# Altium project 2nd_design.PrjPcb
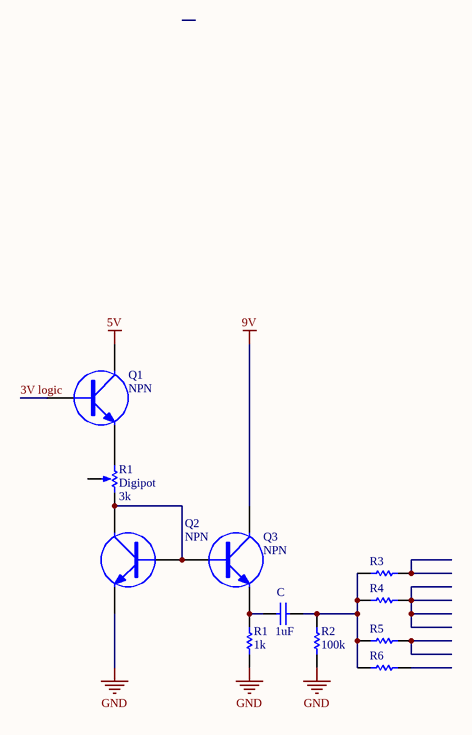
[diagram p0: noConverter.SchDoc]
1 sheet, 11 parts. Net scope: global (net labels, ports and power ports of the same name join across sheets).

## Sheet noConverter.SchDoc
size A

### Parts
(Parts that share a designator on the sheet are numbered #1, #2 ... from top to bottom, then left to right.)
C  value 1uF  [CC5750-2220]  (hidden comment: Cap-NP)
Q1  NPN  [TO-92A]
Q2  NPN  [TO-92A]
Q3  NPN  [TO-92A]
R1#1  Digipot  value 3k  [VR_MUL-H]
R1#2  value 1k  [CC4521-1808]  (hidden comment: Res)
R2  value 100k  [CC4521-1808]  (hidden comment: Res)
R3  Res  [CC4521-1808]  (value not drawn)
R4  Res  [CC4521-1808]  (value not drawn)
R5  Res  [CC4521-1808]  (value not drawn)
R6  Res  [CC4521-1808]  (value not drawn)

### Nets
5V: Q1.1(C)
9V: Q3.1(C)
GND: Q2.3(E) R1#2.2 R2.2
3V logic: Q1.2(B)
NetC_1: C.1 Q3.3(E) R1#2.1
NetC_2: C.2 R2.1 R3.1 R4.1 R5.1 R6.1
NetQ1_3: Q1.3(E) R1#1.1(TOP)
NetQ2_1: Q2.1(C) Q2.2(B) Q3.2(B) R1#1.3(BOT)

Not connected (* = marked no-connect by the designer): R1#1 2(TAP); R3 2; R4 2; R5 2; R6 2

### Library data of the parts
C = Cap-NP: Capacitor; Manufacturer: Generic Components; Class I: Passive; Published: 8-Jun-2000; Revision: July-2002: Re-released for DXP Platform.; Publisher: Altium Limited; Class II: Capacitor
Q1-Q3 = NPN: TO-92A B CENTER,TO-92B B RIGHT
R1#1 = RPot: Potentiometer; Manufacturer: Generic Components; Class I: Passive; Set Position: 0.5; Published: 8-Jun-2000; Revision: July-2002: Re-released for DXP Platform.; Publisher: Altium Limited; Class II: Potentiometer
R1#2 R2-R6 = Res: Resistor; Manufacturer: Generic Components; Class I: Passive; Published: 8-Jun-2000; Revision: July-2002: Re-released for DXP Platform.; Publisher: Altium Limited; Class II: Resistor